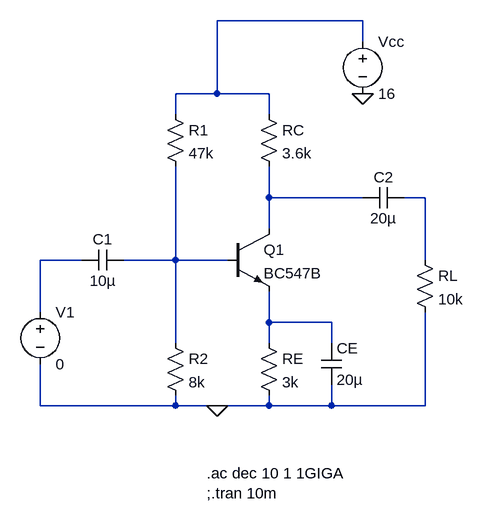
[diagram p0: schematic RC_coupled_amp_N.asc]
RC_coupled_amp_N.asc, the LTspice schematic file:
Version 4
SHEET 1 880 684
WIRE 624 -48 400 -48
WIRE 624 -16 624 -48
WIRE 400 64 400 -48
WIRE 400 64 336 64
WIRE 480 64 400 64
WIRE 336 96 336 64
WIRE 480 96 480 64
WIRE 480 224 480 176
WIRE 624 224 480 224
WIRE 720 224 688 224
WIRE 480 272 480 224
WIRE 192 320 128 320
WIRE 336 320 336 176
WIRE 336 320 256 320
WIRE 416 320 336 320
WIRE 720 320 720 224
WIRE 128 400 128 320
WIRE 480 416 480 368
WIRE 576 416 480 416
WIRE 336 448 336 320
WIRE 480 448 480 416
WIRE 576 448 576 416
WIRE 128 544 128 480
WIRE 336 544 336 528
WIRE 336 544 128 544
WIRE 400 544 336 544
WIRE 480 544 480 528
WIRE 480 544 400 544
WIRE 576 544 576 512
WIRE 576 544 480 544
WIRE 720 544 720 400
WIRE 720 544 576 544
FLAG 400 544 0
FLAG 624 64 0
SYMBOL res 320 80 R0
SYMATTR InstName R1
SYMATTR Value 47k
SYMBOL res 320 432 R0
SYMATTR InstName R2
SYMATTR Value 8k
SYMBOL res 464 80 R0
SYMATTR InstName RC
SYMATTR Value 3.6k
SYMBOL res 464 432 R0
SYMATTR InstName RE
SYMATTR Value 3k
SYMBOL npn 416 272 R0
SYMATTR InstName Q1
SYMATTR Value BC547B
SYMBOL cap 256 304 R90
WINDOW 0 0 32 VBottom 2
WINDOW 3 32 32 VTop 2
SYMATTR InstName C1
SYMATTR Value 10µ
SYMBOL cap 688 208 R90
WINDOW 0 0 32 VBottom 2
WINDOW 3 32 32 VTop 2
SYMATTR InstName C2
SYMATTR Value 20µ
SYMBOL cap 560 448 R0
SYMATTR InstName CE
SYMATTR Value 20µ
SYMBOL res 704 304 R0
SYMATTR InstName RL
SYMATTR Value 10k
SYMBOL voltage 128 384 R0
SYMATTR InstName V1
SYMATTR Value 0
SYMATTR Value2 AC 12m
SYMBOL voltage 624 -32 R0
SYMATTR InstName Vcc
SYMATTR Value 16
TEXT 384 648 Left 2 !.ac dec 10 1 1GIGA\n;.tran 10m

The netlist it stands for:
* RC_coupled_amp_N.asc
R1 N001 N005 47k
R2 N005 0 8k
RC N001 N002 3.6k
RE N006 0 3k
Q1 N002 N005 N006 0 BC547B
C1 N005 N004 10µ
C2 N003 N002 20µ
CE N006 0 20µ
RL N003 0 10k
V1 N004 0 0 AC 12m
Vcc N001 0 16
.model NPN NPN
.model PNP PNP
.lib standard.bjt
.ac dec 10 1 1GIGA
;.tran 10m
.backanno
.end